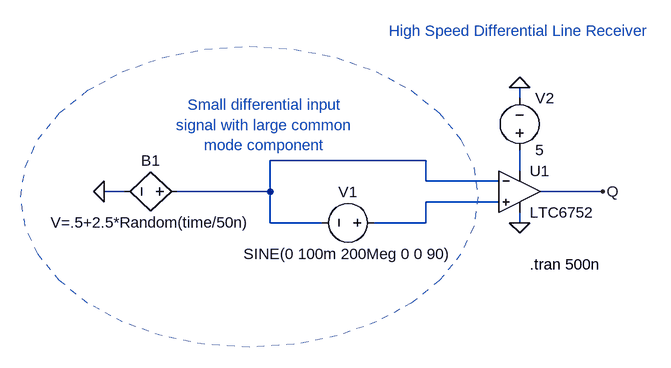
[diagram p0: schematic 6752.asc]
6752.asc, the LTspice schematic file:
Version 4
SHEET 1 1956 1060
WIRE 480 -272 480 -288
WIRE 336 -176 96 -176
WIRE 480 -160 480 -192
WIRE 336 -144 336 -176
WIRE 448 -144 336 -144
WIRE -128 -128 -160 -128
WIRE 96 -128 96 -176
WIRE 96 -128 -48 -128
WIRE 608 -128 512 -128
WIRE 448 -112 336 -112
WIRE 96 -80 96 -128
WIRE 176 -80 96 -80
WIRE 336 -80 336 -112
WIRE 336 -80 256 -80
WIRE 480 -80 480 -96
FLAG 480 -288 0
FLAG 480 -80 0
FLAG 608 -128 Q
FLAG -160 -128 0
SYMBOL voltage 272 -80 R90
WINDOW 3 32 56 VTop 2
WINDOW 123 74 56 VTop 2
WINDOW 39 53 56 VTop 2
WINDOW 0 -32 56 VBottom 2
SYMATTR Value SINE(0 100m 200Meg 0 0 90)
SYMATTR InstName V1
SYMBOL voltage 480 -176 M180
WINDOW 123 24 -26 Left 2
WINDOW 39 24 -5 Left 2
WINDOW 0 24 96 Left 2
WINDOW 3 24 16 Left 2
SYMATTR InstName V2
SYMATTR Value 5
SYMBOL bv -32 -128 R90
WINDOW 0 -32 56 VBottom 2
WINDOW 3 32 56 VTop 2
SYMATTR InstName B1
SYMATTR Value V=.5+2.5*Random(time/50n)
SYMBOL LTC6752 480 -192 R0
SYMATTR InstName U1
TEXT 496 -16 Left 2 !.tran 500n
TEXT 88 -184 Bottom 2 ;Small differential input\nsignal with large common\nmode component
TEXT 480 -360 Bottom 2 ;High Speed Differential Line Receiver
CIRCLE Normal 416 112 -288 -352 2

The netlist it stands for:
* 6752.asc
V1 N003 N001 SINE(0 100m 200Meg 0 0 90)
V2 N002 0 5
B1 N001 0 V=.5+2.5*Random(time/50n)
XU1 N003 N001 N002 0 Q LTC6752  ; pins In+ In- V+ V- OUT
.tran 500n
* Small differential input
* signal with large common
* mode component
* High Speed Differential Line Receiver
.lib LTC7.lib
.backanno
.end